# Altium schematic sheet Sheet1.SchDoc
size A4; PageSetup: Record=PageOptions|CenterHorizontal=True|CenterVertical=True|PrintScale=1.00|XCorrection=1.00|YCorrection=1.00|PrintKind=0|BorderSize=5000000|LeftOffset=0|BottomOffset=0|Orientation=2|PaperLength=1000|PaperWidth=1000|Scale=100|PaperSource=7|PrintQuality=-3|MediaType=1|DitherType=10|PrintScaleMode=1|PaperKind=A4|PaperIndex=9
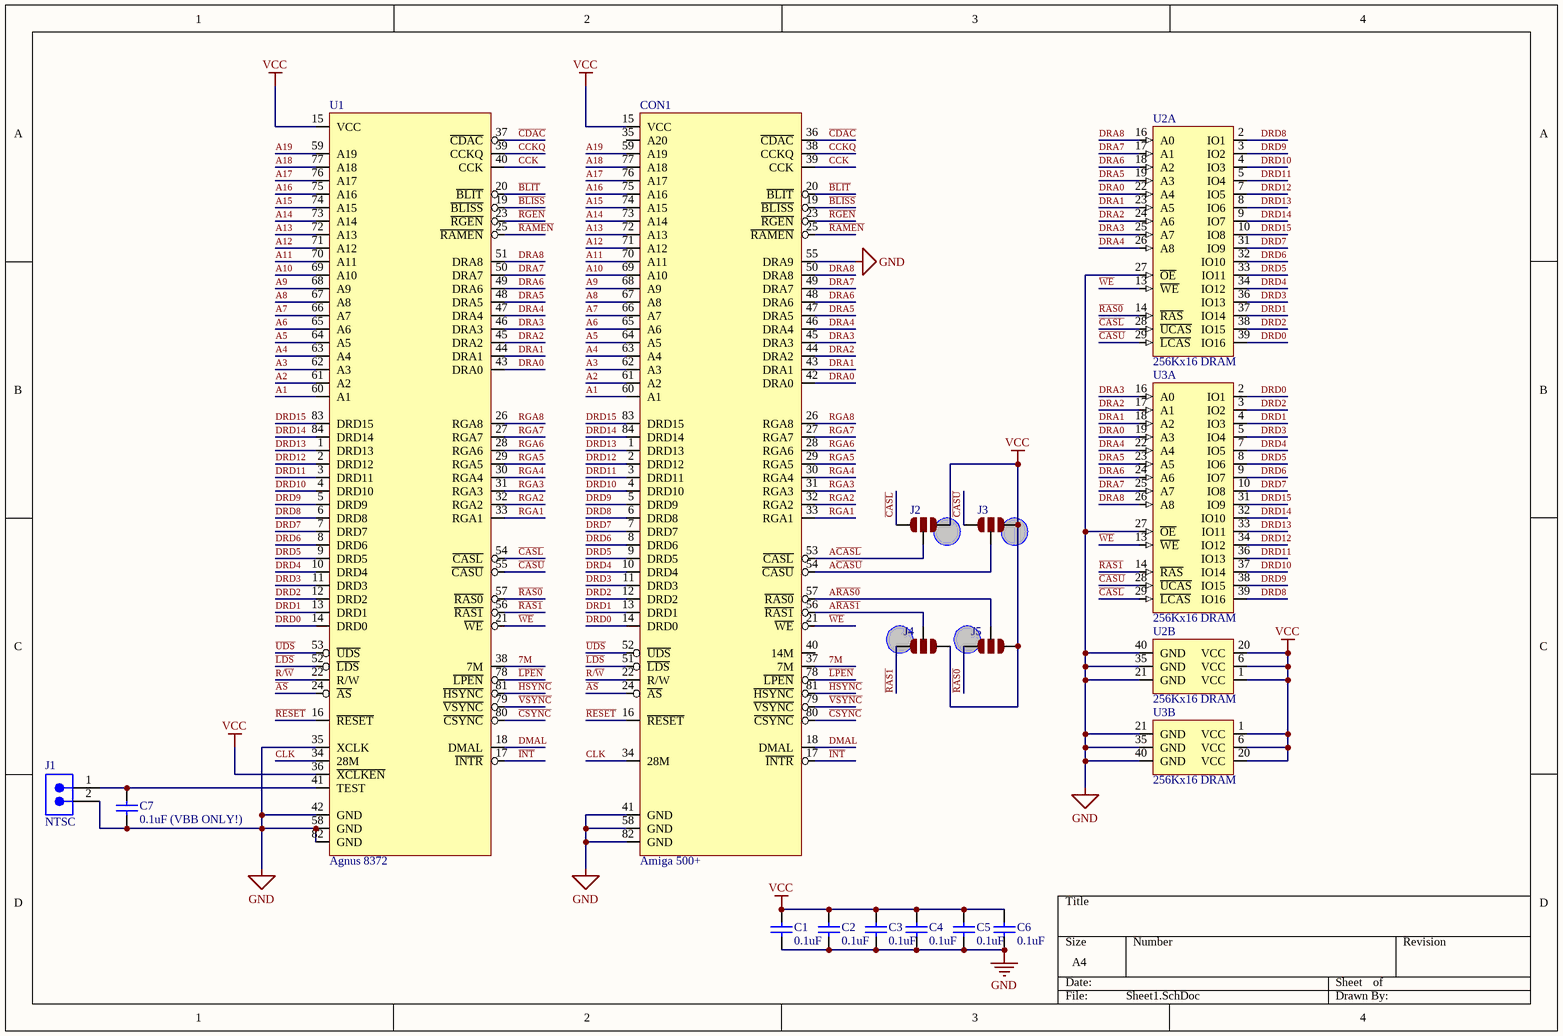
[diagram p0: Sheet1.SchDoc]

## Parts
C1  0.1uF  [CAPC2013X94X50NL20T25]
C2  0.1uF  [CAPC2013X94X50NL20T25]
C3  0.1uF  [CAPC2013X94X50NL20T25]
C4  0.1uF  [CAPC2013X94X50NL20T25]
C5  0.1uF  [CAPC2013X94X50NL20T25]
C6  0.1uF  [CAPC2013X94X50NL20T25]
C7  0.1uF (VBB ONLY!)  [CAPC2013X94X50NL20T25]
CON1  Amiga 500+  [PCB-f427zbry1f2tb6mi5x48-1]
J1  NTSC  [PCB-sec09f5hecotro55xek7-1]
J2  Solder Jumper 2-way  [PCB-rrnqmtokqinrd1vbp5jt-1]  (value not drawn)
J3  Solder Jumper 2-way  [PCB-rrnqmtokqinrd1vbp5jt-1]  (value not drawn)
J4  Solder Jumper 2-way  [PCB-rrnqmtokqinrd1vbp5jt-1]  (value not drawn)
J5  Solder Jumper 2-way  [PCB-rrnqmtokqinrd1vbp5jt-1]  (value not drawn)
U1  Agnus 8372  [PCB-b0jles037xlat36fcw7d-1]
U2  256Kx16 DRAM  [PCB-n8gxwqpdihut7a4d4cwv-1]  (parts A,B of 2)
U3  256Kx16 DRAM  [PCB-n8gxwqpdihut7a4d4cwv-1]  (parts A,B of 2)

## Nets
GND: C1.1 C2.1 C3.1 C4.1 C5.1 C6.1 C7.1 CON1.41(GND) CON1.55(DRA9) CON1.58(GND) CON1.82(GND) J1.2 U1.35(XCLK) U1.42(GND) U1.58(GND) U1.82(GND) U2.21(GND) U2.27(~{OE}) U2.35(GND) U2.40(GND) U3.21(GND) U3.27(~{OE}) U3.35(GND) U3.40(GND)
VCC: C1.2 C2.2 C3.2 C4.2 C5.2 C6.2 CON1.15(VCC) J2.1 J3.1 J4.3 J5.3 U1.15(VCC) U1.36(~{XCLKEN}) U2.1(VCC) U2.6(VCC) U2.20(VCC) U3.1(VCC) U3.6(VCC) U3.20(VCC)
7M: CON1.37(7M) U1.38(7M)
A1: CON1.60(A1) U1.60(A1)
A2: CON1.61(A2) U1.61(A2)
A3: CON1.62(A3) U1.62(A3)
A4: CON1.63(A4) U1.63(A4)
A5: CON1.64(A5) U1.64(A5)
A6: CON1.65(A6) U1.65(A6)
A7: CON1.66(A7) U1.66(A7)
A8: CON1.67(A8) U1.67(A8)
A9: CON1.68(A9) U1.68(A9)
A10: CON1.69(A10) U1.69(A10)
A11: CON1.70(A11) U1.70(A11)
A12: CON1.71(A12) U1.71(A12)
A13: CON1.72(A13) U1.72(A13)
A14: CON1.73(A14) U1.73(A14)
A15: CON1.74(A15) U1.74(A15)
A16: CON1.75(A16) U1.75(A16)
A17: CON1.76(A17) U1.76(A17)
A18: CON1.77(A18) U1.77(A18)
A19: CON1.59(A19) U1.59(A19)
~{AS}: CON1.24(~{AS}) U1.24(~{AS})
A~{CASL}: CON1.53(~{CASL}) J2.2
A~{CASU}: CON1.54(~{CASU}) J3.2
A~{RAS0}: CON1.57(~{RAS0}) J5.2
A~{RAS1}: CON1.56(~{RAS1}) J4.2
~{BLISS}: CON1.19(~{BLISS}) U1.19(~{BLISS})
~{BLIT}: CON1.20(~{BLIT}) U1.20(~{BLIT})
~{CASL}: J2.3 U1.54(~{CASL}) U2.28(~{UCAS}) U3.29(~{LCAS})
~{CASU}: J3.3 U1.55(~{CASU}) U2.29(~{LCAS}) U3.28(~{UCAS})
~{CDAC}: CON1.36(~{CDAC}) U1.37(~{CDAC})
~{CSYNC}: CON1.80(~{CSYNC}) U1.80(~{CSYNC})
CCK: CON1.39(CCK) U1.40(CCK)
CCKQ: CON1.38(CCKQ) U1.39(CCKQ)
CLK: CON1.34(28M) U1.34(28M)
DMAL: CON1.18(DMAL) U1.18(DMAL)
DRA0: CON1.42(DRA0) U1.43(DRA0) U2.22(A4) U3.19(A3)
DRA1: CON1.43(DRA1) U1.44(DRA1) U2.23(A5) U3.18(A2)
DRA2: CON1.44(DRA2) U1.45(DRA2) U2.24(A6) U3.17(A1)
DRA3: CON1.45(DRA3) U1.46(DRA3) U2.25(A7) U3.16(A0)
DRA4: CON1.46(DRA4) U1.47(DRA4) U2.26(A8) U3.22(A4)
DRA5: CON1.47(DRA5) U1.48(DRA5) U2.19(A3) U3.23(A5)
DRA6: CON1.48(DRA6) U1.49(DRA6) U2.18(A2) U3.24(A6)
DRA7: CON1.49(DRA7) U1.50(DRA7) U2.17(A1) U3.25(A7)
DRA8: CON1.50(DRA8) U1.51(DRA8) U2.16(A0) U3.26(A8)
DRD0: CON1.14(DRD0) U1.14(DRD0) U2.39(IO16) U3.2(IO1)
DRD1: CON1.13(DRD1) U1.13(DRD1) U2.37(IO14) U3.4(IO3)
DRD2: CON1.12(DRD2) U1.12(DRD2) U2.38(IO15) U3.3(IO2)
DRD3: CON1.11(DRD3) U1.11(DRD3) U2.36(IO13) U3.5(IO4)
DRD4: CON1.10(DRD4) U1.10(DRD4) U2.34(IO12) U3.7(IO5)
DRD5: CON1.9(DRD5) U1.9(DRD5) U2.33(IO11) U3.8(IO6)
DRD6: CON1.8(DRD6) U1.8(DRD6) U2.32(IO10) U3.9(IO7)
DRD7: CON1.7(DRD7) U1.7(DRD7) U2.31(IO9) U3.10(IO8)
DRD8: CON1.6(DRD8) U1.6(DRD8) U2.2(IO1) U3.39(IO16)
DRD9: CON1.5(DRD9) U1.5(DRD9) U2.3(IO2) U3.38(IO15)
DRD10: CON1.4(DRD10) U1.4(DRD10) U2.4(IO3) U3.37(IO14)
DRD11: CON1.3(DRD11) U1.3(DRD11) U2.5(IO4) U3.36(IO13)
DRD12: CON1.2(DRD12) U1.2(DRD12) U2.7(IO5) U3.34(IO12)
DRD13: CON1.1(DRD13) U1.1(DRD13) U2.8(IO6) U3.33(IO11)
DRD14: CON1.84(DRD14) U1.84(DRD14) U2.9(IO7) U3.32(IO10)
DRD15: CON1.83(DRD15) U1.83(DRD15) U2.10(IO8) U3.31(IO9)
~{HSYNC}: CON1.81(~{HSYNC}) U1.81(~{HSYNC})
~{INT}: CON1.17(~{INTR}) U1.17(~{INTR})
~{LDS}: CON1.51(~{LDS}) U1.52(~{LDS})
~{LPEN}: CON1.78(~{LPEN}) U1.78(~{LPEN})
R/~{W}: CON1.22(R/W) U1.22(R/W)
~{RAMEN}: CON1.25(~{RAMEN}) U1.25(~{RAMEN})
~{RAS0}: J5.1 U1.57(~{RAS0}) U2.14(~{RAS})
~{RAS1}: J4.1 U1.56(~{RAS1}) U3.14(~{RAS})
~{RESET}: CON1.16(~{RESET}) U1.16(~{RESET})
~{RGEN}: CON1.23(~{RGEN}) U1.23(~{RGEN})
RGA1: CON1.33(RGA1) U1.33(RGA1)
RGA2: CON1.32(RGA2) U1.32(RGA2)
RGA3: CON1.31(RGA3) U1.31(RGA3)
RGA4: CON1.30(RGA4) U1.30(RGA4)
RGA5: CON1.29(RGA5) U1.29(RGA5)
RGA6: CON1.28(RGA6) U1.28(RGA6)
RGA7: CON1.27(RGA7) U1.27(RGA7)
RGA8: CON1.26(RGA8) U1.26(RGA8)
~{UDS}: CON1.52(~{UDS}) U1.53(~{UDS})
~{VSYNC}: CON1.79(~{VSYNC}) U1.79(~{VSYNC})
~{WE}: CON1.21(~{WE}) U1.21(~{WE}) U2.13(~{WE}) U3.13(~{WE})
NetC7_2: C7.2 J1.1 U1.41(TEST)

Not connected (* = marked no-connect by the designer): CON1 35(A20) 40(14M); U2 11(NC) 12(NC) 15(NC) 30(NC); U3 11(NC) 12(NC) 15(NC) 30(NC)

## Library data of the parts
C1-C7 = CMP-126070-2: CAP CER 0.1UF 25V Y5V 0805; Manufacturer Part Number: 08053G104ZAT2A; Capacitance: 1e-07 F; Capacitance Tolerance: +80/-20%; Case/Package (SI): 2012; Lead-Free Status: Lead Free; Voltage Rating (DC): 25.0 V; Case/Package: 0805; Dielectric Characteristic: Y5V; Mounting Style: Surface Mount; Number of Pins: 2; Octopart Url: https://octopart.com/08053g104zat2a-avx+interconnect+%2F+elco-194972; OctopartID: 3033f93becc9eff4; Packaging: Cut Tape (CT); REACH SVHC Compliance: No SVHC; RoHS: Compliant; Size-Height: 0.00071 m; Size-Length: 0.00201 m; Size-Width: 0.00125 m
CON1 = CMP-7khi6ttu66jii6hcxoo5-2: 2MB Agnus (A500+/A600); CustomComponentID: 7khi6ttu66jii6hcxoo5
J1 = CMP-lodcp8skmwpqidhah0u1-1: 2-pos Pin header - through hole; CustomComponentID: lodcp8skmwpqidhah0u1
J2-J5 = CMP-0rfjo47dqw9gp5mzow1m-3: SMD Jumper; CustomComponentID: 0rfjo47dqw9gp5mzow1m
U1 = CMP-efwu862vrdu0d84ikc4y-5: 1MB Agnus (A500/2000); CustomComponentID: efwu862vrdu0d84ikc4y
U2 U3 = CMP-dvzdks2b65agtcocd5fi-1: Generic 256Kx16 DRAM; CustomComponentID: dvzdks2b65agtcocd5fi